# Altium schematic sheet CoreBoard.SchDoc
size C; SheetNumber: 1; SheetTotal: 5
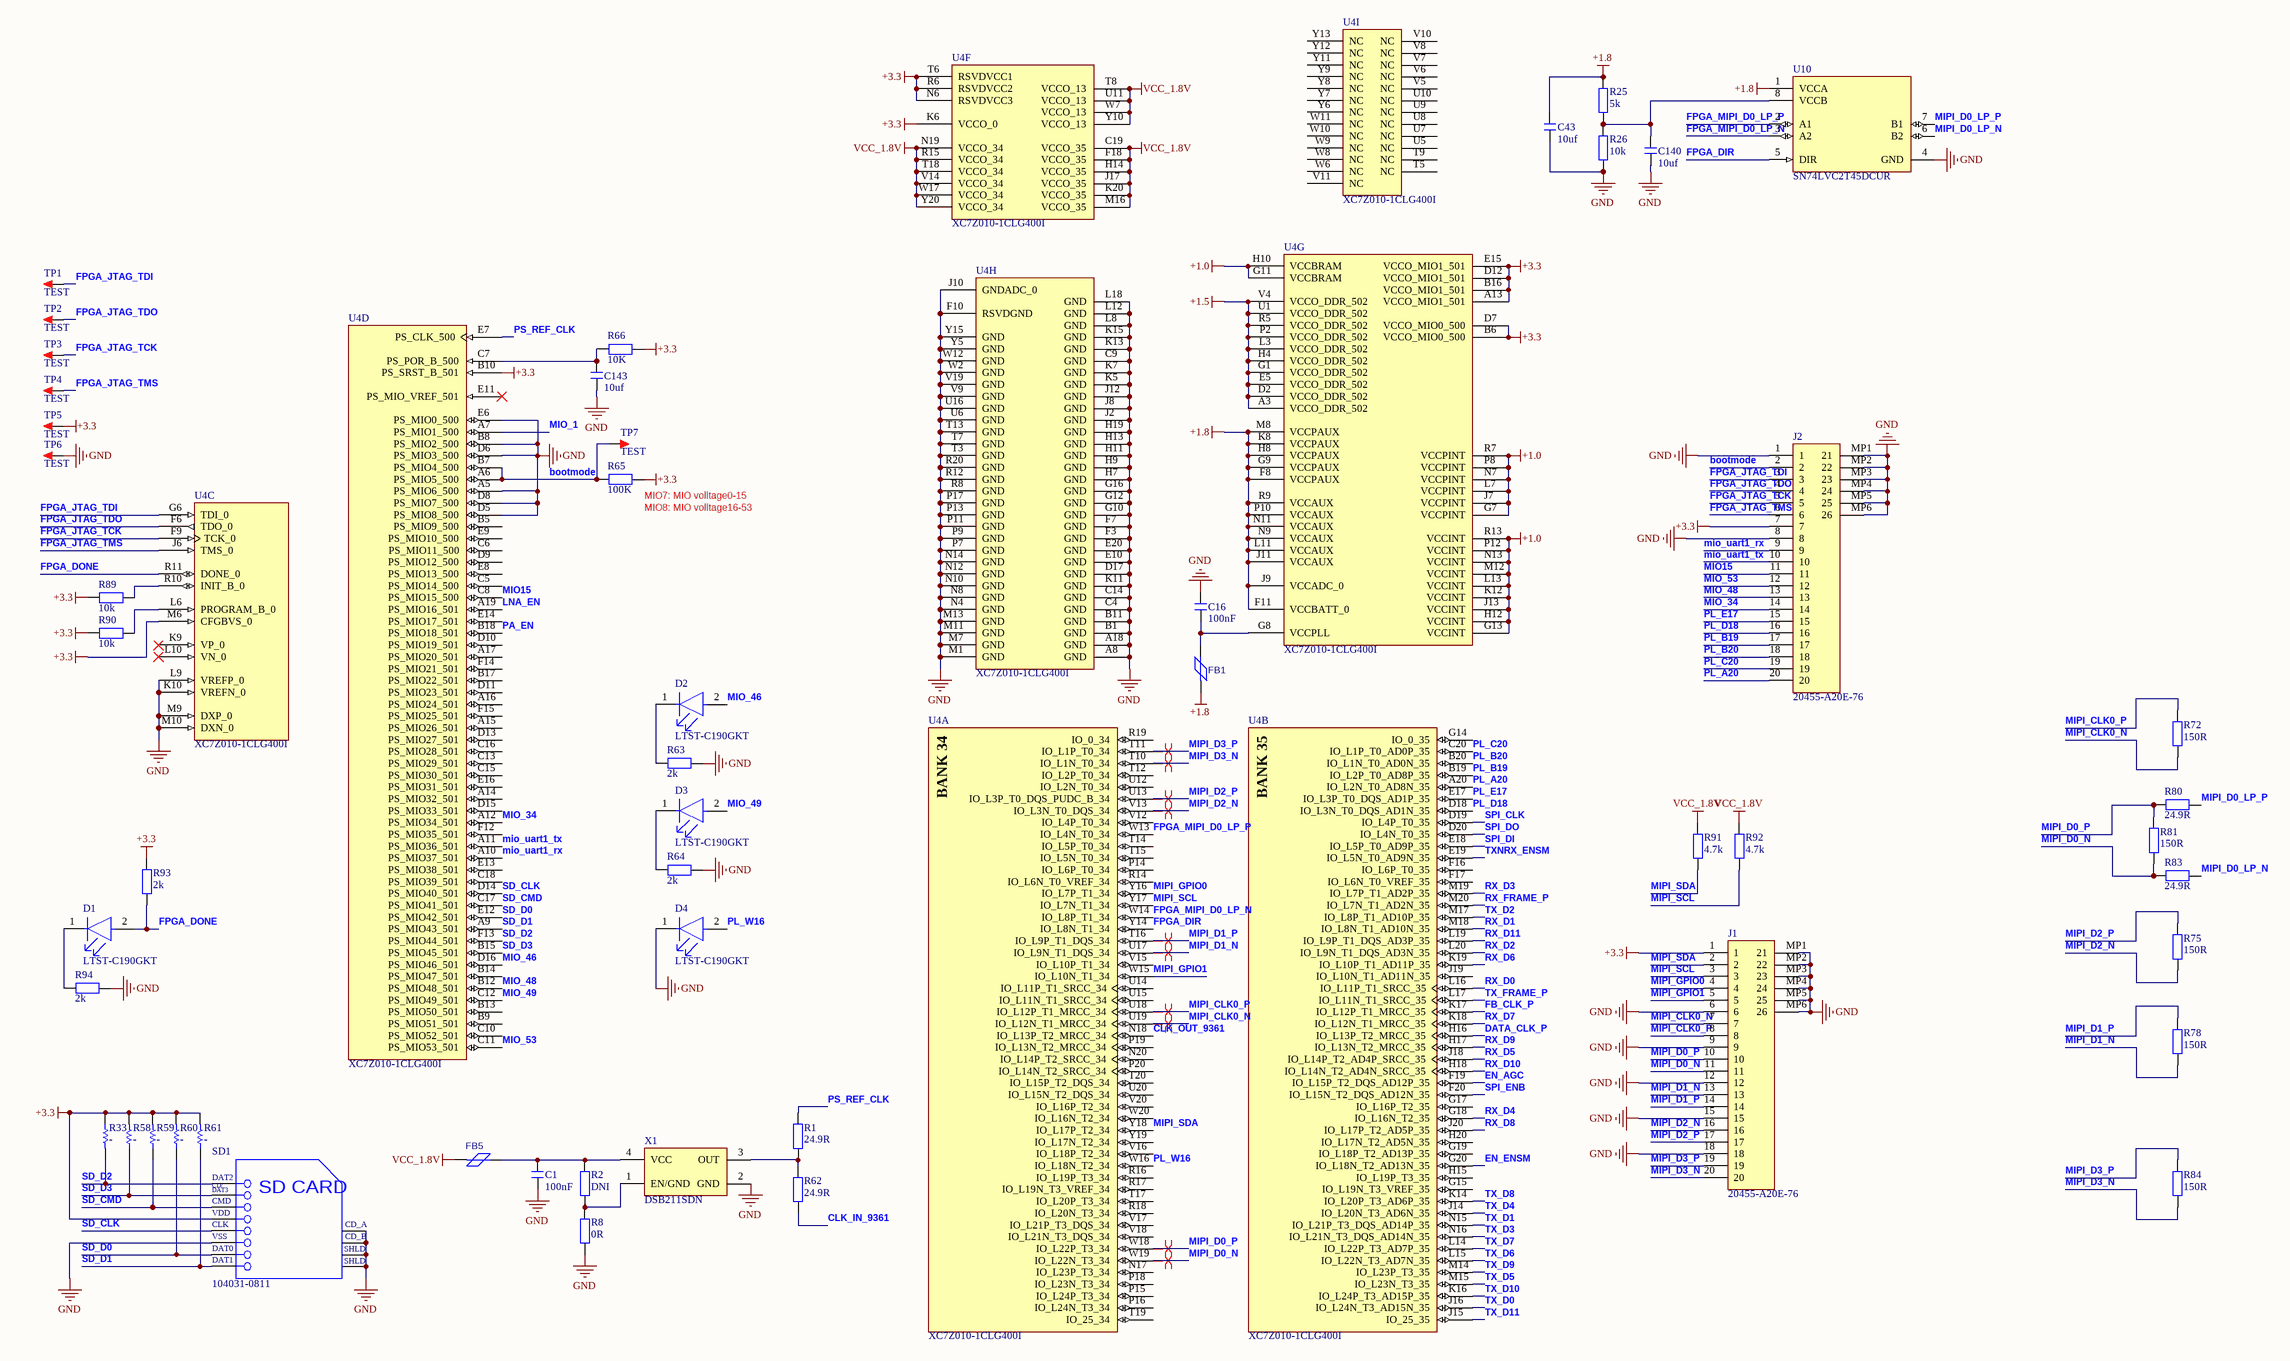
[diagram p0: CoreBoard.SchDoc]

## Parts
C1  100nF  [CAP_0402]
C16  100nF  [CAP_0201]
C43  10uf  [CAP_0402]
C140  10uf  [CAP_0402]
C143  10uf  [CAP_0402]
D1  LTST-C190GKT  [FP-LTST-C190GKT-MFG]
D2  LTST-C190GKT  [FP-LTST-C190GKT-MFG]
D3  LTST-C190GKT  [FP-LTST-C190GKT-MFG]
D4  LTST-C190GKT  [FP-LTST-C190GKT-MFG]
FB1  BLM15PX331SN1D  [RES_0201]  (value not drawn)
FB5  BLM15PX331SN1D  [RES_0402]  (value not drawn)
J1  20455-A20E-76  [20455A20E76]
J2  20455-A20E-76  [20455A20E76]
R1  24.9R  [RES_0402]
R2  DNI  [RES_0402]
R8  0R  [RES_0402]
R25  5k  [RES_0402]
R26  10k  [RES_0402]
R33  -  [RES_0402]
R58  -  [RES_0402]
R59  -  [RES_0402]
R60  -  [RES_0402]
R61  -  [RES_0402]
R62  24.9R  [RES_0402]
R63  2k  [RES_0402]
R64  2k  [RES_0402]
R65  100K  [RES_0201]
R66  10K  [RES_0201]
R72  150R  [RES_0201]
R75  150R  [RES_0201]
R78  150R  [RES_0201]
R80  24.9R  [RES_0402]
R81  150R  [RES_0201]
R83  24.9R  [RES_0402]
R84  150R  [RES_0201]
R89  10k  [RES_0201]
R90  10k  [RES_0201]
R91  4.7k  [RES_0402]
R92  4.7k  [RES_0402]
R93  2k  [RES_0201]
R94  2k  [RES_0402]
SD1  104031-0811  [MOLX-104031-0811_V]
TP1  TEST  [TEST 0.8]
TP2  TEST  [TEST 0.8]
TP3  TEST  [TEST 0.8]
TP4  TEST  [TEST 0.8]
TP5  TEST  [TEST 0.8]
TP6  TEST  [TEST 0.8]
TP7  TEST  [TEST 0.8]
U4  XC7Z010-1CLG400I  [CLG400]  (parts A,B,C,D,F,G,H,I of 9)
U10  SN74LVC2T45DCUR  [FP-DCU0008A-IPC_A]
X1  DSB211SDN  [DSB211SDN]

## Nets
+1.0: U4.G7(VCCPINT) U4.G11(VCCBRAM) U4.G13(VCCINT) U4.H10(VCCBRAM) U4.H12(VCCINT) U4.J7(VCCPINT) U4.J13(VCCINT) U4.K12(VCCINT) U4.L7(VCCPINT) U4.L13(VCCINT) U4.M12(VCCINT) U4.N7(VCCPINT) U4.N13(VCCINT) U4.P8(VCCPINT) U4.P12(VCCINT) U4.R7(VCCPINT) U4.R13(VCCINT)
+1.5: U4.A3(VCCO_DDR_502) U4.D2(VCCO_DDR_502) U4.E5(VCCO_DDR_502) U4.G1(VCCO_DDR_502) U4.H4(VCCO_DDR_502) U4.L3(VCCO_DDR_502) U4.P2(VCCO_DDR_502) U4.R5(VCCO_DDR_502) U4.U1(VCCO_DDR_502) U4.V4(VCCO_DDR_502)
+1.8: C43.1 FB1.1 R25.1 U4.F8(VCCPAUX) U4.F11(VCCBATT_0) U4.G9(VCCPAUX) U4.H8(VCCPAUX) U4.J9(VCCADC_0) U4.J11(VCCAUX) U4.K8(VCCPAUX) U4.L11(VCCAUX) U4.M8(VCCPAUX) U4.N9(VCCAUX) U4.N11(VCCAUX) U4.P10(VCCAUX) U4.R9(VCCAUX) U10.1(VCCA)
+3.3: J1.1 J2.7 R33.1 R58.2 R59.2 R60.2 R61.2 R65.2 R66.2 R89.2 R90.2 R93.2 SD1.4(VDD) TP5.1 U4.A13(VCCO_MIO1_501) U4.B6(VCCO_MIO0_500) U4.B10(PS_SRST_B_501) U4.B16(VCCO_MIO1_501) U4.D7(VCCO_MIO0_500) U4.D12(VCCO_MIO1_501) U4.E15(VCCO_MIO1_501) U4.K6(VCCO_0) U4.M6(CFGBVS_0) U4.N6(RSVDVCC3) U4.R6(RSVDVCC2) U4.T6(RSVDVCC1)
GND: C1.2 C16.2 C43.2 C140.2 C143.2 D4.1(C) J1.6 J1.9 J1.12 J1.15 J1.18 J1.MP1(21) J1.MP2(22) J1.MP3(23) J1.MP4(24) J1.MP5(25) J1.MP6(26) J2.1 J2.8 J2.MP1(21) J2.MP2(22) J2.MP3(23) J2.MP4(24) J2.MP5(25) J2.MP6(26) R8.1 R26.2 R63.1 R64.1 R94.1 SD1.6(VSS2) SD1.9(CD_A) SD1.10(CD_B) SD1.11(SHLD1) SD1.12(SHLD2) TP6.1 U4.A5(PS_MIO6_500) U4.A8(GND) U4.A18(GND) U4.B1(GND) U4.B8(PS_MIO2_500) U4.B11(GND) U4.C4(GND) U4.C9(GND) U4.C14(GND) U4.D5(PS_MIO8_500) U4.D6(PS_MIO3_500) U4.D8(PS_MIO7_500) U4.D17(GND) U4.E6(PS_MIO0_500) U4.E10(GND) U4.E20(GND) U4.F3(GND) U4.F7(GND) U4.F10(RSVDGND) U4.G10(GND) U4.G12(GND) U4.G16(GND) U4.H7(GND) U4.H9(GND) U4.H11(GND) U4.H13(GND) U4.H19(GND) U4.J2(GND) U4.J8(GND) U4.J10(GNDADC_0) U4.J12(GND) U4.K5(GND) U4.K7(GND) U4.K10(VREFN_0) U4.K11(GND) U4.K13(GND) U4.K15(GND) U4.L8(GND) U4.L9(VREFP_0) U4.L12(GND) U4.L18(GND) U4.M1(GND) U4.M7(GND) U4.M9(DXP_0) U4.M10(DXN_0) U4.M11(GND) U4.M13(GND) U4.N4(GND) U4.N8(GND) U4.N10(GND) U4.N12(GND) U4.N14(GND) U4.P7(GND) U4.P9(GND) U4.P11(GND) U4.P13(GND) U4.P17(GND) U4.R8(GND) U4.R12(GND) U4.R20(GND) U4.T3(GND) U4.T7(GND) U4.T13(GND) U4.U6(GND) U4.U16(GND) U4.V9(GND) U4.V19(GND) U4.W2(GND) U4.W12(GND) U4.Y5(GND) U4.Y15(GND) U10.4(GND) X1.2(GND)
VCC_1.8V: FB5.1 R91.1 R92.1 U4.C19(VCCO_35) U4.F18(VCCO_35) U4.H14(VCCO_35) U4.J17(VCCO_35) U4.K20(VCCO_35) U4.M16(VCCO_35) U4.N19(VCCO_34) U4.R15(VCCO_34) U4.T8(VCCO_13) U4.T18(VCCO_34) U4.U11(VCCO_13) U4.V14(VCCO_34) U4.W7(VCCO_13) U4.W17(VCCO_34) U4.Y10(VCCO_13) U4.Y20(VCCO_34)
bootmode: J2.2 R65.1 TP7.1 U4.A6(PS_MIO5_500) U4.B7(PS_MIO4_500)
CLK_IN_9361: R62.2
CLK_OUT_9361: U4.N18(IO_L13P_T2_MRCC_34)
DATA_CLK_P: U4.H16(IO_L13P_T2_MRCC_35)
EN_AGC: U4.F19(IO_L15P_T2_DQS_AD12P_35)
EN_ENSM: U4.G20(IO_L18N_T2_AD13N_35)
FB_CLK_P: U4.K17(IO_L12P_T1_MRCC_35)
FPGA_DIR: U4.Y14(IO_L8N_T1_34) U10.5(DIR)
FPGA_DONE: D1.2(A) R93.1 U4.R11(DONE_0)
FPGA_JTAG_TCK: J2.5 TP3.1 U4.F9(TCK_0)
FPGA_JTAG_TDI: J2.3 TP1.1 U4.G6(TDI_0)
FPGA_JTAG_TDO: J2.4 TP2.1 U4.F6(TDO_0)
FPGA_JTAG_TMS: J2.6 TP4.1 U4.J6(TMS_0)
FPGA_MIPI_D0_LP_N: U4.W14(IO_L8P_T1_34) U10.3(A2)
FPGA_MIPI_D0_LP_P: U4.W13(IO_L4N_T0_34) U10.2(A1)
LNA_EN: U4.A19(PS_MIO16_501)
MIO15: J2.11 U4.C8(PS_MIO15_500)
MIO_1: U4.A7(PS_MIO1_500)
MIO_34: J2.14 U4.A12(PS_MIO34_501)
MIO_46: D2.2(A) U4.D16(PS_MIO46_501)
MIO_48: J2.13 U4.B12(PS_MIO48_501)
MIO_49: D3.2(A) U4.C12(PS_MIO49_501)
MIO_53: J2.12 U4.C11(PS_MIO53_501)
mio_uart1_rx: J2.9 U4.A10(PS_MIO37_501)
mio_uart1_tx: J2.10 U4.A11(PS_MIO36_501)
MIPI_CLK0_N: J1.7 R72.2 U4.U19(IO_L12N_T1_MRCC_34)
MIPI_CLK0_P: J1.8 R72.1 U4.U18(IO_L12P_T1_MRCC_34)
MIPI_D0_LP_N: R83.1 U10.6(B2)
MIPI_D0_LP_P: R80.1 U10.7(B1)
MIPI_D0_N: J1.11 R81.2 R83.2 U4.W19(IO_L22N_T3_34)
MIPI_D0_P: J1.10 R80.2 R81.1 U4.W18(IO_L22P_T3_34)
MIPI_D1_N: J1.13 R78.2 U4.U17(IO_L9N_T1_DQS_34)
MIPI_D1_P: J1.14 R78.1 U4.T16(IO_L9P_T1_DQS_34)
MIPI_D2_N: J1.16 R75.2 U4.V13(IO_L3N_T0_DQS_34)
MIPI_D2_P: J1.17 R75.1 U4.U13(IO_L3P_T0_DQS_PUDC_B_34)
MIPI_D3_N: J1.20 R84.2 U4.T10(IO_L1N_T0_34)
MIPI_D3_P: J1.19 R84.1 U4.T11(IO_L1P_T0_34)
MIPI_GPIO0: J1.4 U4.Y16(IO_L7P_T1_34)
MIPI_GPIO1: J1.5 U4.W15(IO_L10N_T1_34)
MIPI_SCL: J1.3 R92.2 U4.Y17(IO_L7N_T1_34)
MIPI_SDA: J1.2 R91.2 U4.Y18(IO_L17P_T2_34)
PA_EN: U4.B18(PS_MIO18_501)
PL_A20: J2.20 U4.A20(IO_L2N_T0_AD8N_35)
PL_B19: J2.17 U4.B19(IO_L2P_T0_AD8P_35)
PL_B20: J2.18 U4.B20(IO_L1N_T0_AD0N_35)
PL_C20: J2.19 U4.C20(IO_L1P_T0_AD0P_35)
PL_D18: J2.16 U4.D18(IO_L3N_T0_DQS_AD1N_35)
PL_E17: J2.15 U4.E17(IO_L3P_T0_DQS_AD1P_35)
PL_W16: D4.2(A) U4.W16(IO_L18N_T2_34)
PS_REF_CLK: R1.1 U4.E7(PS_CLK_500)
RX_D0: U4.L16(IO_L11P_T1_SRCC_35)
RX_D1: U4.M18(IO_L8N_T1_AD10N_35)
RX_D2: U4.L20(IO_L9N_T1_DQS_AD3N_35)
RX_D3: U4.M19(IO_L7P_T1_AD2P_35)
RX_D4: U4.G18(IO_L16N_T2_35)
RX_D5: U4.J18(IO_L14P_T2_AD4P_SRCC_35)
RX_D6: U4.K19(IO_L10P_T1_AD11P_35)
RX_D7: U4.K18(IO_L12N_T1_MRCC_35)
RX_D8: U4.J20(IO_L17P_T2_AD5P_35)
RX_D9: U4.H17(IO_L13N_T2_MRCC_35)
RX_D10: U4.H18(IO_L14N_T2_AD4N_SRCC_35)
RX_D11: U4.L19(IO_L9P_T1_DQS_AD3P_35)
RX_FRAME_P: U4.M20(IO_L7N_T1_AD2N_35)
SD_CLK: SD1.5(CLK) U4.D14(PS_MIO40_501)
SD_CMD: R59.1 SD1.3(VSS1) U4.C17(PS_MIO41_501)
SD_D0: R60.1 SD1.7(DAT0) U4.E12(PS_MIO42_501)
SD_D1: R61.1 SD1.8(DAT1) U4.A9(PS_MIO43_501)
SD_D2: R33.2 SD1.1(CD/DAT3) U4.F13(PS_MIO44_501)
SD_D3: R58.1 SD1.2(CMD) U4.B15(PS_MIO45_501)
SPI_CLK: U4.D19(IO_L4P_T0_35)
SPI_DI: U4.E18(IO_L5P_T0_AD9P_35)
SPI_DO: U4.D20(IO_L4N_T0_35)
SPI_ENB: U4.F20(IO_L15N_T2_DQS_AD12N_35)
TX_D0: U4.J16(IO_L24N_T3_AD15N_35)
TX_D1: U4.N15(IO_L21P_T3_DQS_AD14P_35)
TX_D2: U4.M17(IO_L8P_T1_AD10P_35)
TX_D3: U4.N16(IO_L21N_T3_DQS_AD14N_35)
TX_D4: U4.J14(IO_L20N_T3_AD6N_35)
TX_D5: U4.M15(IO_L23N_T3_35)
TX_D6: U4.L15(IO_L22N_T3_AD7N_35)
TX_D7: U4.L14(IO_L22P_T3_AD7P_35)
TX_D8: U4.K14(IO_L20P_T3_AD6P_35)
TX_D9: U4.M14(IO_L23P_T3_35)
TX_D10: U4.K16(IO_L24P_T3_AD15P_35)
TX_D11: U4.J15(IO_25_35)
TX_FRAME_P: U4.L17(IO_L11N_T1_SRCC_35)
TXNRX_ENSM: U4.E19(IO_L5N_T0_AD9N_35)
NetC1_1: C1.1 FB5.2 R2.2 X1.4(VCC)
NetC16_1: C16.1 FB1.2 U4.G8(VCCPLL)
NetC140_1: C140.1 R25.2 R26.1 U10.8(VCCB)
NetC143_1: C143.1 R66.1 U4.C7(PS_POR_B_500)
NetD1_1: D1.1(C) R94.2
NetD2_1: D2.1(C) R63.2
NetD3_1: D3.1(C) R64.2
NetR1_2: R1.2 R62.1 X1.3(OUT)
NetR2_1: R2.1 R8.2 X1.1(EN/GND)
NetR89_1: R89.1 U4.R10(INIT_B_0)
NetR90_1: R90.1 U4.L6(PROGRAM_B_0)

Not connected (* = marked no-connect by the designer): U4 A14(PS_MIO32_501) A15(PS_MIO26_501) A16(PS_MIO24_501) A17(PS_MIO20_501) B5(PS_MIO9_500) B9(PS_MIO51_501) B13(PS_MIO50_501) B14(PS_MIO47_501) B17(PS_MIO22_501) C5(PS_MIO14_500) C6(PS_MIO11_500) C10(PS_MIO52_501) C13(PS_MIO29_501) C15(PS_MIO30_501) C16(PS_MIO28_501) C18(PS_MIO39_501) D9(PS_MIO12_500) D10(PS_MIO19_501) D11(PS_MIO23_501) D13(PS_MIO27_501) D15(PS_MIO33_501) E8(PS_MIO13_500) E9(PS_MIO10_500) E11(PS_MIO_VREF_501)* E13(PS_MIO38_501) E14(PS_MIO17_501) E16(PS_MIO31_501) F12(PS_MIO35_501) F14(PS_MIO21_501) F15(PS_MIO25_501) F16(IO_L6P_T0_35) F17(IO_L6N_T0_VREF_35) G14(IO_0_35) G15(IO_L19N_T3_VREF_35) G17(IO_L16P_T2_35) G19(IO_L18P_T2_AD13P_35) H15(IO_L19P_T3_35) H20(IO_L17N_T2_AD5N_35) J19(IO_L10N_T1_AD11N_35) K9(VP_0)* L10(VN_0)* N17(IO_L23P_T3_34) N20(IO_L14P_T2_SRCC_34) P14(IO_L6P_T0_34) P15(IO_L24P_T3_34) P16(IO_L24N_T3_34) P18(IO_L23N_T3_34) P19(IO_L13N_T2_MRCC_34) P20(IO_L14N_T2_SRCC_34) R14(IO_L6N_T0_VREF_34) R16(IO_L19P_T3_34) R17(IO_L19N_T3_VREF_34) R18(IO_L20N_T3_34) R19(IO_0_34) T5(NC) T9(NC) T12(IO_L2P_T0_34) T14(IO_L5P_T0_34) T15(IO_L5N_T0_34) T17(IO_L20P_T3_34) T19(IO_25_34) T20(IO_L15P_T2_DQS_34) U5(NC) U7(NC) U8(NC) U9(NC) U10(NC) U12(IO_L2N_T0_34) U14(IO_L11P_T1_SRCC_34) U15(IO_L11N_T1_SRCC_34) U20(IO_L15N_T2_DQS_34) V5(NC) V6(NC) V7(NC) V8(NC) V10(NC) V11(NC) V12(IO_L4P_T0_34) V15(IO_L10P_T1_34) V16(IO_L18P_T2_34) V17(IO_L21P_T3_DQS_34) V18(IO_L21N_T3_DQS_34) V20(IO_L16P_T2_34) W6(NC) W8(NC) W9(NC) W10(NC) W11(NC) W20(IO_L16N_T2_34) Y6(NC) Y7(NC) Y8(NC) Y9(NC) Y11(NC) Y12(NC) Y13(NC) Y19(IO_L17N_T2_34)

## Layout directives
differential pair: MIPI_CLK0_N, MIPI_CLK0_P, MIPI_D0_N, MIPI_D0_P, MIPI_D1_N, MIPI_D1_P, MIPI_D2_N, MIPI_D2_P, MIPI_D3_N, MIPI_D3_P

## Notes on the sheet
- (near R65) MIO7: MIO volltage0-15
- (near R65) MIO8: MIO volltage16-53
- (in symbol CMP-0363-00008-3, part A) BANK 34
- (in symbol CMP-0363-00008-3, part B) BANK 35
- (in symbol CMP-2000-05825-1) DAT2; CD/; DAT3; SD CARD; VSS; SHLD

## Library data of the parts
C1 C16 C43 C140 C143 = C: 无极性贴片电容; 版权归属: 源创客; BOM名称: 无极性贴片电容; 学习资源: www.ooocke.com
D1-D4 = CMP-22017-000005-2: LED GREEN CLEAR CHIP SMD; Dominant Wavelength: 569nm; Reverse Voltage: 5V; Lens Color: Colorless; Viewing Angle: 130°; Voltage: 2V; Forward Current: 30mA; Power Dissipation: 100mW; Luminous Intensity: 6mcd; Number of LEDs: 1; Forward Voltage: 2.1V; Wavelength: 565nm; Test Current: 10mA; Min Operating Temperature: -55°C; Lens Style: Clear; Mount: Surface Mount; Width: 0.8mm; Packaging: Tape and Reel; Lens Transparency: Clear; Case Code (Metric): 1608; Depth: 0.8mm; Case Code (Imperial): 0603; Case/Package: 0603; Number of Pins: 2; Max Operating Temperature: 85°C; Lead Free: Lead Free; Number of Elements: 1; Length: 1.6mm; Height: 0.8mm; Package Quantity: 1; Power Rating: 100mW; Radiation Hardening: No; Illumination Color: Green; Color: Green
FB1 FB5 = BLM15PX331SN1D: 330 Ohms @ 100 MHz 1 Power Line Ferrite Bead 0402 (1005 Metric) 1.2A 150mOhm from Murata Electronics; Contributor: LCSC; BOM_Supplier: LCSC; BOM_Supplier Part: C160975; BOM_Manufacturer: Murata Electronics; BOM_Manufacturer Part: BLM15PX331SN1D; spicePre: U; spiceSymbolName: BLM15PX331SN1D
J1 J2 = 20455-A20E-76: Connector; Manufacturer_Name: I-Pex; Datasheet Link: https://www.i-pex.com/sites/default/files/downloads/pdf/2D_CABLINE-VS_RECEPTACLE_20455C30.pdf; Height: 1.1mm; Manufacturer_Part_Number: 20455-A20E-76
R1 R2 R8 R25 R26 R62-R66 R72 R75 R78 R80 R81 R83 R84 R89-R94 = R: 贴片电阻; 版权归属: 源创客; BOM名称: 贴片电阻; 学习资源: www.ooocke.com
R33 R58-R61 = RES
SD1 = CMP-2000-05825-1: Micro SD Card, RA, -25 to 85 degC, 8-Pin SMD, RoHS, Tape and Reel; Voltage Rating: 10VAC/DC; Number of Contacts: 8; Insertion - Extraction Style: Push-Pull; Pitch: 1.1mm; Mating Cycles: 10000; Brand: Molex; Current Rating: 500mA; Manufacturer URL: http://www.molex.com/; Card Type: microSD; Mounting Type: Standard; Height: 1.42mm; Mounting Technology: SurfaceMount; Contact Plating: Gold; Product Category: MemoryCardConnectors; Package Description: 8-Pin Surface Mount Device, Body 11.95 x 11.4 mm, Pitch 1.1 mm; Datasheet URL: http://www.molex.com/pdm_docs/sd/1040310811_sd.pdf; Termination Style: SMD; Length: 11.4mm; Housing Material: LiquidCrystalPolymer(LCP); Orientation: RightAngle; RoHS: True; Contact Material: PhosphorBronze; Datasheet Version: Rev. E, 04/2006; Packaging: Reel; Manufacturer: Molex; Series: 104031; Product: CardConnectors; Number of Rows: 1Row; Package Reference: 104031-0811
TP1-TP7 = TEST: 测试点; 版权归属: 源创客; BOM名称: 测试点; 学习资源: www.ooocke.com
U4 = CMP-0363-00008-3: 667 MHz Zynq™-7000 AP SoC, 130 PS I/O, 100 FPGA I/O, 400-Ball BGA, Speed Grade 1, Industrial Grade, Pb-Free; Speed Grade: -1; LUTs: 17600; Extensible Block RAM (# 36Kb Blocks): 240 KB (60); Flip Flops: 35200; PartNumber: XC7Z010-1CLG400I; Mounting Technology: Surface Mount; ComponentLink5URL: http://www.xilinx.com/support/documentation/user_guides/ug865-Zynq-7000-Pkg-Pinout.pdf; ComponentLink3URL: http://www.xilinx.com/support/documentation/data_sheets/ds187-XC7Z010-XC7Z020-Data-Sheet.pdf; PackageVersion: Rev 1.1, 09/2012; ComponentLink2Description: Package Specification; ComponentLink4Description: Package File; ComponentLink2URL: http://www.xilinx.com/support/documentation/user_guides/ug865-Zynq-7000-Pkg-Pinout.pdf; ComponentLink3Description: DC and AC Switching Characteristics; ComponentLink6Description: PCB and Layout Guide; ComponentLink4URL: http://www.xilinx.com/support/packagefiles/z7packages/xc7z010clg400pkg.txt; ComponentLink1URL: http://www.xilinx.com/support/documentation/data_sheets/ds190-Zynq-7000-Overview.pdf; Generic Part Number: XC7Z010; PackageReference: CLG400; ComponentLink1Description: Datasheet; RoHS: Pb-Free; ComponentLink6URL: http://www.xilinx.com/support/documentation/user_guides/ug483_7Series_PCB.pdf; DatasheetVersion: v1.2; PackageDescription: Wire-Bond Chip-Scale BGA, Body 17 x 17 mm, 0.8 mm Pitch; ComponentLink5Description: Packaging and Pinout; Code_JEDEC: MO-275-MMAA-1
U10 = CMP-0859-00011-5: IC TRNSLTR BIDIRECTIONAL US8; Quiescent Current: 3uA; Number of Channels: 2; High Level Output Current: -32mA; Min Supply Voltage: 1.65V; Max Supply Voltage: 5.5V; Data Rate: 420Mbps; Turn-On Delay Time: 45.2ns; Low Level Output Current: 32mA; Logic Function: Translator; Number of Elements: 1; Output Current: 50mA; Polarity: Non-Inverting; Radiation Hardening: No; Height: 2.9mm; Package Quantity: 3000; Contact Plating: Gold; Length: 3.15mm; Number of Inputs: 2; Min Operating Temperature: -40°C; Lead Free: Lead Free; Number of Bits: 2; Propagation Delay: 45.2ns; Number of Pins: 8; REACH SVHC: No SVHC; Weight: 0.000339oz; Case/Package: VSSOP; Packaging: Tape and Reel; Direction: Bidirectional; Max Operating Temperature: 85°C; Number of Transceivers: 2; Width: 1.2mm; Termination: SMD/SMT
X1 = DSB211SDN: High-precision SMD VC-TCXO/TCXO; Manufacturer_Name: KDS Daishinku; Datasheet Link: https://www.kds.info/wp-content/uploads/2015/11/p023-064_en.pdf; Height: 0.8mm; Manufacturer_Part_Number: DSB211SDN